# EAGLE design ATtiny_dev_board (EAGLE 9.1.3)
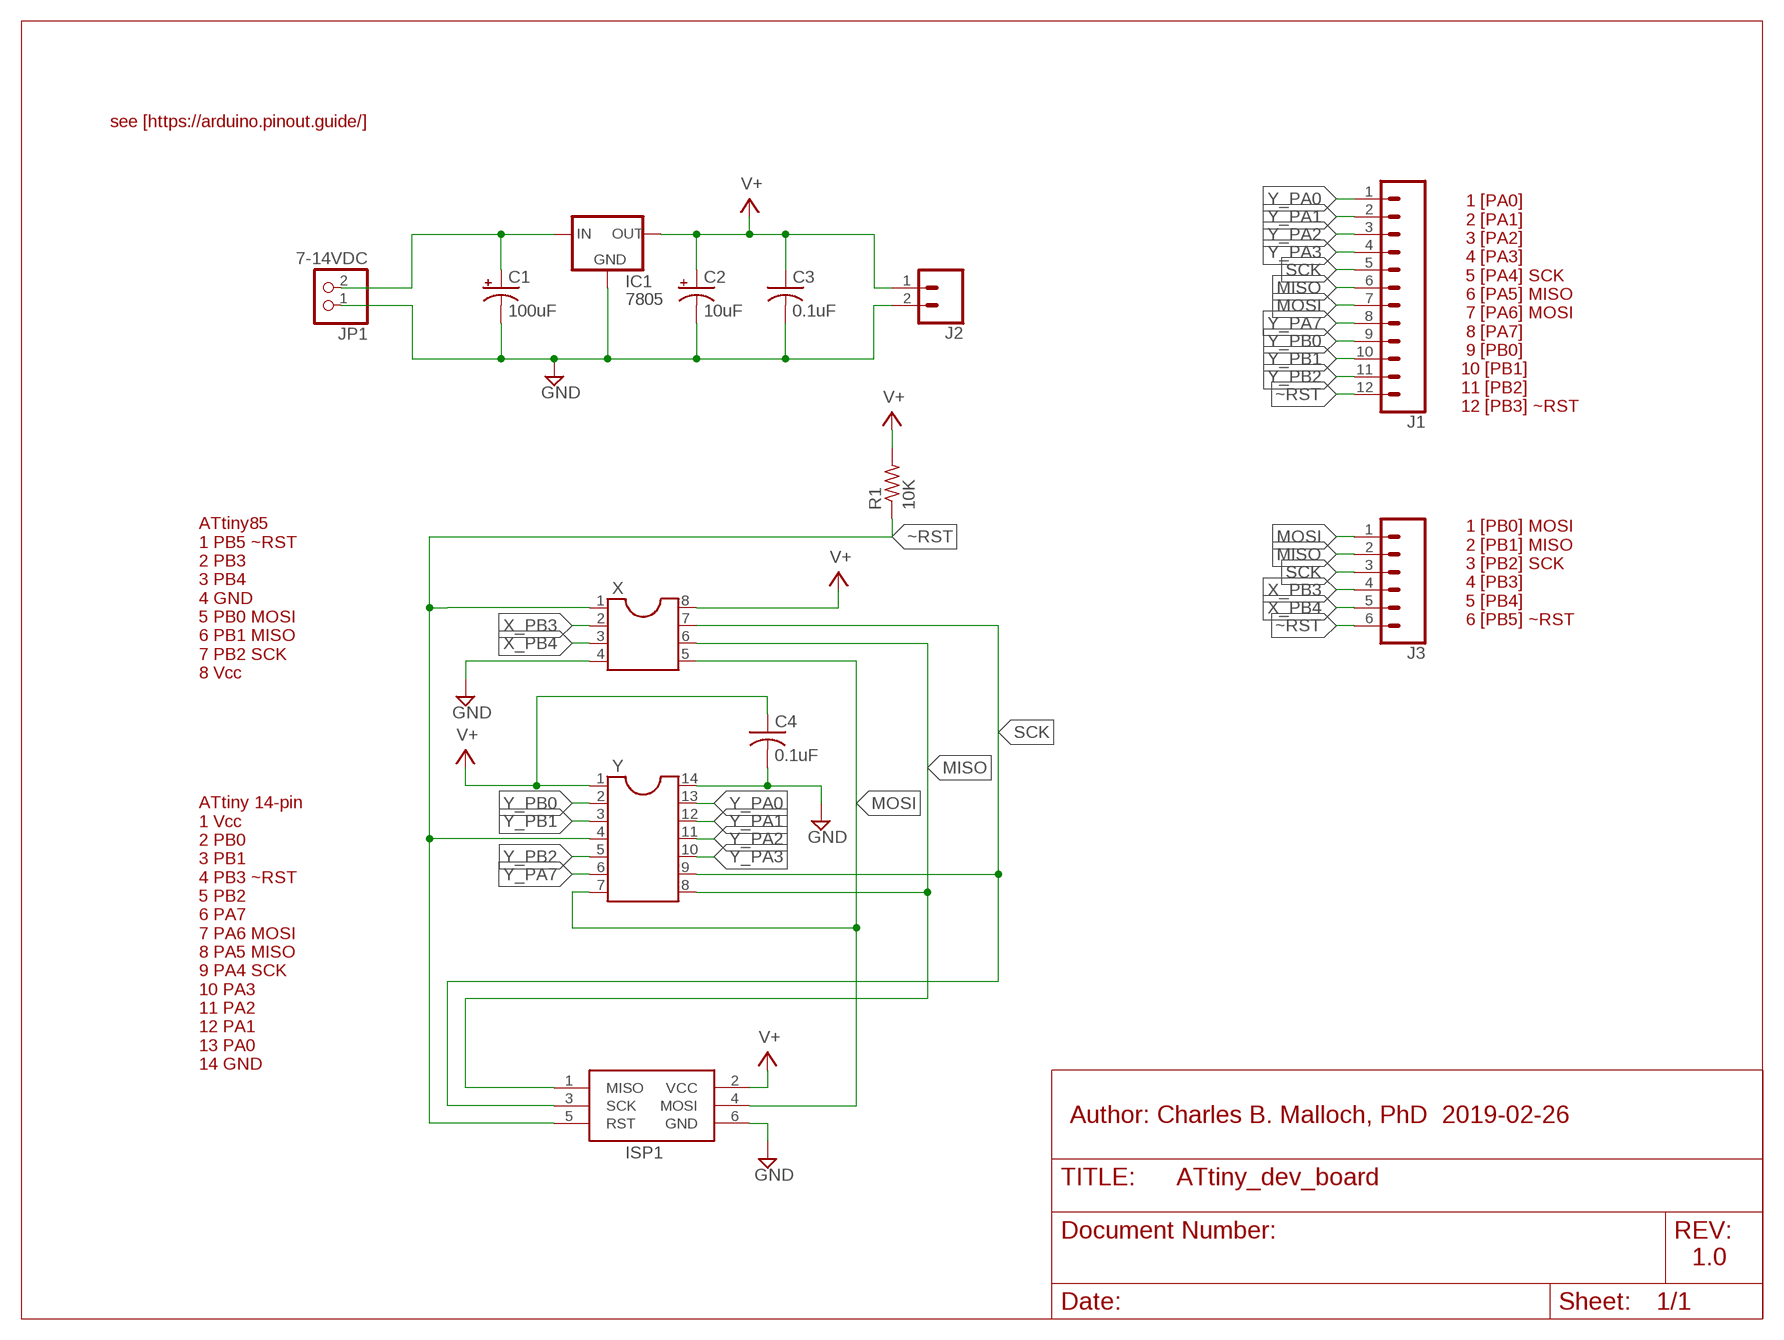
[diagram p0: schematic, sheet 1]

## Parts
C1  100uF  CPOL-USTT2D7  [TT2D7]
C2  10uF  CPOL-USE1.8-4  [E1,8-4]
C3  0.1uF  C-US025-025X050  [C025-025X050]
C4  0.1uF  C-US025-025X050  [C025-025X050]
IC1  7805  V_REG_78XX-TO-220  [TO-220-ALT]
ISP1  AVRISP-BOX  [AVRISP-BOX]
J1  CONN_12LOCK_LONGPADS  [1X12_LOCK_LONGPADS]
J2  CONN_02LOCK_LONGPADS  [1X02_LOCK_LONGPADS]
J3  CONN_06LOCK_LONGPADS  [1X06_LOCK_LONGPADS]
JP1  7-14VDC  PINHD-1X2  [1X02]
R1  10K  R-US_0309/12  [0309/12]
X  DIL8S  [SOCKET-08]
Y  DIL14S  [SOCKET-14]

## Nets
5VDC [POWER]: C2.+ C3.1 C4.1 IC1.OUT ISP1.2(VCC) J2.1 R1.2 X.8 Y.1 ; supply symbol labelled V+
GND [POWER]: C1.- C2.- C3.2 C4.2 IC1.GND ISP1.6(GND) J2.2 JP1.1 X.4 Y.14
MISO: ISP1.1(MISO) J1.6 J3.2 X.6 Y.8
MOSI: ISP1.4(MOSI) J1.7 J3.1 X.5 Y.7
SCK: ISP1.3(SCK) J1.5 J3.3 X.7 Y.9
VIN [POWER]: C1.+ IC1.IN JP1.2
X_PB3: J3.4 X.2
X_PB4: J3.5 X.3
Y_PA0: J1.1 Y.13
Y_PA1: J1.2 Y.12
Y_PA2: J1.3 Y.11
Y_PA3: J1.4 Y.10
Y_PA7: J1.8 Y.6
Y_PB0: J1.9 Y.2
Y_PB1: J1.10 Y.3
Y_PB2: J1.11 Y.5
~RST: ISP1.5(RST) J1.12 J3.6 R1.1 X.1 Y.4

## Notes on the sheet
- see [https://arduino.pinout.guide/]
- 1 [PA0]
   2 [PA1]
   3 [PA2]
   4 [PA3]
   5 [PA4] SCK
   6 [PA5] MISO
   7 [PA6] MOSI
   8 [PA7]
   9 [PB0]
  10 [PB1]
  11 [PB2]
  12 [PB3] ~RST
- 1 [PB0] MOSI
   2 [PB1] MISO
   3 [PB2] SCK
   4 [PB3]
   5 [PB4]
   6 [PB5] ~RST
- ATtiny85
  1 PB5 ~RST
  2 PB3
  3 PB4
  4 GND
  5 PB0 MOSI
  6 PB1 MISO
  7 PB2 SCK
  8 Vcc
- ATtiny 14-pin
  1 Vcc
  2 PB0
  3 PB1
  4 PB3 ~RST
  5 PB2
  6 PA7
  7 PA6 MOSI
  8 PA5 MISO
  9 PA4 SCK
  10 PA3
  11 PA2
  12 PA1
  13 PA0
  14 GND
- Author: Charles B. Malloch, PhD  2019-02-26
- 1.0

## Library data of the parts
C1 C2 = adafruit:CPOL-US: POLARIZED CAPACITOR, American symbol
C3 C4 = adafruit:C-US: CAPACITOR, American symbol
IC1 = SparkFun-PowerIC:V_REG_78XX: Voltage Regulator Standard 7805 5V regulator. IGO (Input Ground Output). Spark Fun Electronics SKU : COM-00107
ISP1 = adafruit:AVRISP: AVR ISP HEADER Standard 6 pin header for AVR programming
J1 = SparkFun-Connectors:CONN_12: Multi connection point. Often used as Generic Header-pin footprint for 0.1 inch spaced/style header connections On any of the 0.1 inch spaced packages, you can populate with these: Break Away Headers - Straight <https://www.sparkfun.com/products/116> (PRT-00116) Break Away Male Headers - Right Angle <https://www.sparkfun.com/products/553> (PRT-00553) Female Headers <https://www.sparkfun.com/products/115> (PRT-00115) Break Away Headers - Machine Pin <https://www.sparkfun.com/products/117> (PRT-00117) Break Away Female Headers - Swiss Machine Pin <https://www.sparkfun.com/products/743> (PRT-00743) For SCREWTERMINALS and SPRING TERMINALS visit here: Screw Terimnals on SparkFun.com <https://www.sparkfun.com/search/results?term=Screw+Terminals> (5mm/3.5mm/2.54mm spacing) This device is also useful as a general connection point to wire up your design to another part of your project. Our various solder wires solder well into these plated through hole pads. Hook-Up Wire - Assortment (Stranded, 22 AWG) <https://www.sparkfun.com/products/11375> (PRT-11375) Hook-Up Wire - Assortment (Solid Core, 22 AWG) <https://www.sparkfun.com/products/11367> (PRT-11367) View the entire wire category on our website here <https://www.sparkfun.com/categories/141> Special notes: Molex polarized connector foot print use with SKU : PRT-08231 with associated crimp pins and housings. 1MM SMD Version SKU: PRT-10208 NOTES ON THE VARIANTS LOCK and LOCK_LONGPADS... This footprint was designed to help hold the alignment of a through-hole component (i.e. 6-pin header) while soldering it into place. You may notice that each hole has been shifted either up or down by 0.005 of an inch from it's more standard position (which is a perfectly straight line). This slight alteration caused the pins (the squares in the middle) to touch the edges of the holes. Because they are alternating, it causes a "brace" to hold the component in place. 0.005 has proven to be the perfect amount of "off-center" position when using our standard breakaway headers. Although looks a little odd when you look at the bare footprint, once you have a header in there, the alteration is very hard to notice. Also,if you push a header all the way into place, it is covered up entirely on the bottom side.
J2 = SparkFun-Connectors:CONN_02: Multi connection point. Often used as Generic Header-pin footprint for 0.1 inch spaced/style header connections On any of the 0.1 inch spaced packages, you can populate with these: Break Away Headers - Straight <https://www.sparkfun.com/products/116> (PRT-00116) Break Away Male Headers - Right Angle <https://www.sparkfun.com/products/553> (PRT-00553) Female Headers <https://www.sparkfun.com/products/115> (PRT-00115) Break Away Headers - Machine Pin <https://www.sparkfun.com/products/117> (PRT-00117) Break Away Female Headers - Swiss Machine Pin <https://www.sparkfun.com/products/743> (PRT-00743) For SCREWTERMINALS and SPRING TERMINALS visit here: Screw Terimnals on SparkFun.com <https://www.sparkfun.com/search/results?term=Screw+Terminals> (5mm/3.5mm/2.54mm spacing) This device is also useful as a general connection point to wire up your design to another part of your project. Our various solder wires solder well into these plated through hole pads. Hook-Up Wire - Assortment (Stranded, 22 AWG) <https://www.sparkfun.com/products/11375> (PRT-11375) Hook-Up Wire - Assortment (Solid Core, 22 AWG) <https://www.sparkfun.com/products/11367> (PRT-11367) View the entire wire category on our website here <https://www.sparkfun.com/categories/141> Special notes: Molex polarized connector foot print use with: PRT-08233 with associated crimp pins and housings. 2.54_SCREWTERM for use with PRT-10571. 3.5mm Screw Terminal footprints for PRT-08084 5mm Screw Terminal footprints for use with PRT-08432
J3 = SparkFun-Connectors:CONN_06: Multi connection point. Often used as Generic Header-pin footprint for 0.1 inch spaced/style header connections On any of the 0.1 inch spaced packages, you can populate with these: Break Away Headers - Straight <https://www.sparkfun.com/products/116> (PRT-00116) Break Away Male Headers - Right Angle <https://www.sparkfun.com/products/553> (PRT-00553) Female Headers <https://www.sparkfun.com/products/115> (PRT-00115) Break Away Headers - Machine Pin <https://www.sparkfun.com/products/117> (PRT-00117) Break Away Female Headers - Swiss Machine Pin <https://www.sparkfun.com/products/743> (PRT-00743) Arduino Stackable Header - 6 Pin <https://www.sparkfun.com/products/9280> (PRT-09280) For SCREWTERMINALS and SPRING TERMINALS visit here: Screw Terimnals on SparkFun.com <https://www.sparkfun.com/search/results?term=Screw+Terminals> (5mm/3.5mm/2.54mm spacing) This device is also useful as a general connection point to wire up your design to another part of your project. Our various solder wires solder well into these plated through hole pads. Hook-Up Wire - Assortment (Stranded, 22 AWG) <https://www.sparkfun.com/products/11375> (PRT-11375) Hook-Up Wire - Assortment (Solid Core, 22 AWG) <https://www.sparkfun.com/products/11367> (PRT-11367) View the entire wire category on our website here <https://www.sparkfun.com/categories/141>
JP1 = pinhead:PINHD-1X2: PIN HEADER
R1 = resistor:R-US_: RESISTOR, American symbol
X = ic-package:DIL8: Dual In Line / Socket
Y = ic-package:DIL14: Dual In Line / Socket

## Net classes
1 POWER: width 0.61 mm, clearance 0.305 mm

## Board
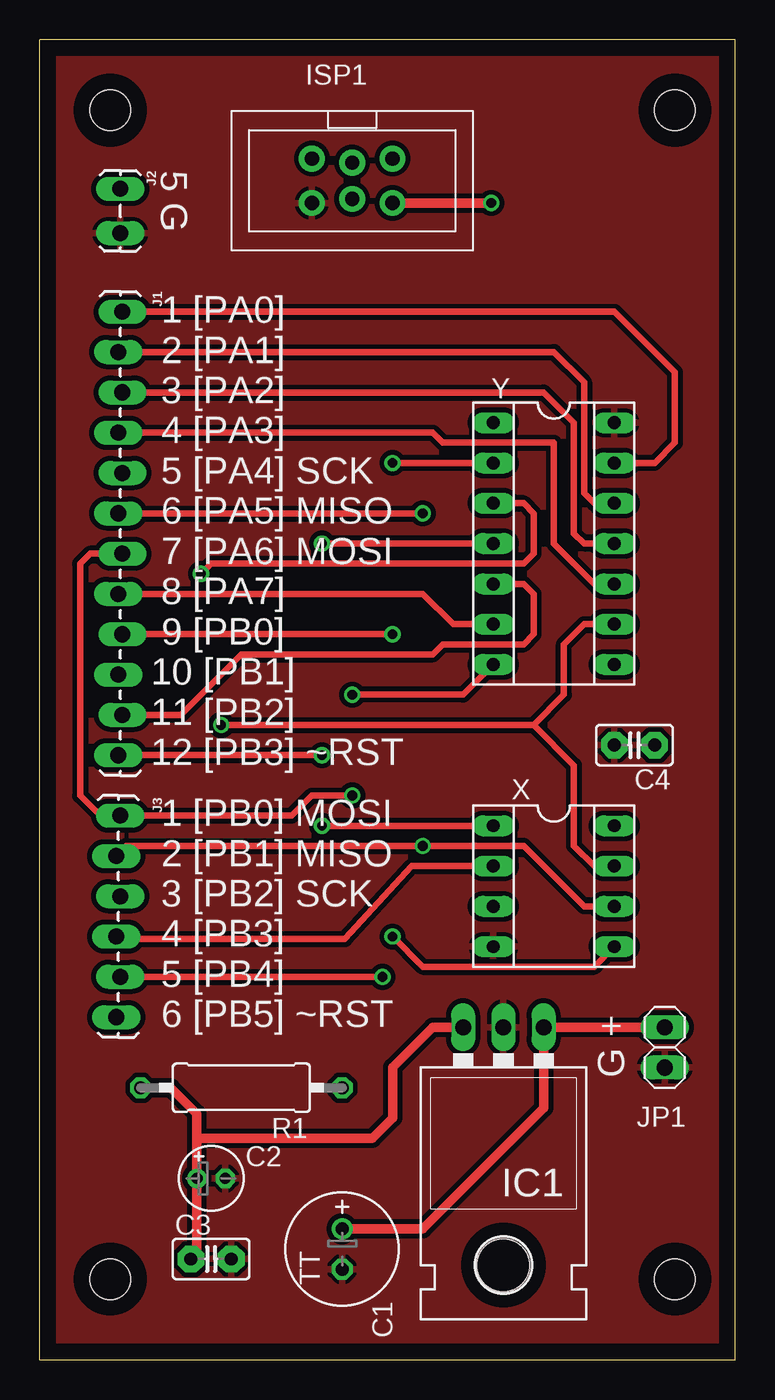
[diagram p1: board, top side]
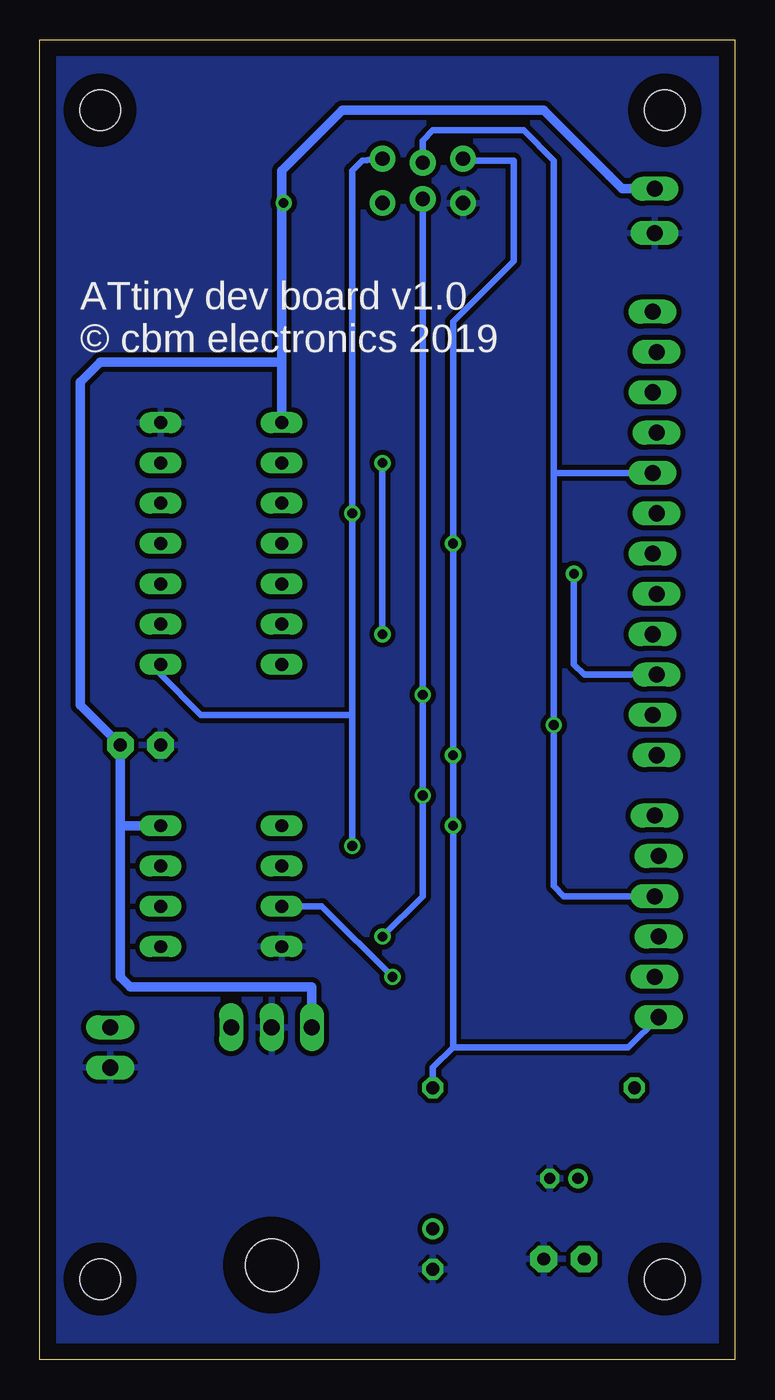
[diagram p2: board, bottom side, seen from below]

Size 43.82 x 83.19 mm. Coordinates in mm from the lower left corner, seen from the top.
Outline: 0,0 43.82,0 43.82,83.19 0,83.19 0,0
Copper layers (1*16): Top 0.035mm / dielectric 1.5mm / Bottom 0.035mm
Design rules "default": minimum track width 10mil, minimum drill 24mil, track to track 8mil, track to pad 8mil, pad to pad 8mil, via to via 8mil, smd to smd 8mil, copper to edge 40mil, drill to drill 8mil, minimum pad ring 10mil, minimum via ring 8mil, stop-mask expansion 4mil, vias tented up to drill 0mil, thermal gap 10mil
Holes 2.54 mm at 4.45,5.08 40.01,5.08 40.01,78.74 4.45,78.74

### Footprints (pad centres in the part's own frame; a part is rotated, then mirrored left to right if it is on the bottom)
TT2D7 = drill 0.813: + -1.27,0 | drill 0.813 octagon: - 1.27,0
E1,8-4 = drill 0.711 pad 1.168: + -0.889,0 | drill 0.711 pad 1.168 octagon: - 0.889,0
C025-025X050 = drill 0.813 pad 1.676 octagon: 1 -1.27,0; 2 1.27,0
TO-220-ALT = drill 1.016 long: GND 0,-3.81; IN -2.54,-3.81; OUT 2.54,-3.81 | hole 3.302: 0,11.176
AVRISP-BOX = drill 0.9 pad 1.626: 1 -1.397,2.54; 2 1.397,2.54; 3 -1.143,0; 4 1.143,0; 5 -1.397,-2.54; 6 1.397,-2.54
1X12_LOCK_LONGPADS = drill 1.016 long: 1 0,0.127; 2 2.54,-0.127; 3 5.08,0.127; 4 7.62,-0.127; 5 10.16,0.127; 6 12.7,-0.127; 7 15.24,0.127; 8 17.78,-0.127; 9 20.32,0.127; 10 22.86,-0.127; 11 25.4,0.127; 12 27.94,-0.127
1X02_LOCK_LONGPADS = drill 1.016 long: 1 -0.127,0; 2 2.667,0
1X06_LOCK_LONGPADS = drill 1.016 long: 1 0,0; 2 2.54,-0.254; 3 5.08,0; 4 7.62,-0.254; 5 10.16,0; 6 12.7,-0.254
1X02 = drill 1.016 long: 1 -1.27,0; 2 1.27,0
0309/12 = drill 0.813 octagon: 1 -6.35,0; 2 6.35,0
SOCKET-08 = drill 0.813 long: 1 -3.81,-3.81; 2 -1.27,-3.81; 3 1.27,-3.81; 4 3.81,-3.81; 5 3.81,3.81; 6 1.27,3.81; 7 -1.27,3.81; 8 -3.81,3.81
SOCKET-14 = drill 0.813 long: 1 -7.62,-3.81; 2 -5.08,-3.81; 3 -2.54,-3.81; 4 0,-3.81; 5 2.54,-3.81; 6 5.08,-3.81; 7 7.62,-3.81; 8 7.62,3.81; 9 5.08,3.81; 10 2.54,3.81; 11 0,3.81; 12 -2.54,3.81; 13 -5.08,3.81; 14 -7.62,3.81

### Placement (x,y rotation side)
C1  19.05,6.99 270 top
C2  10.79,11.43 0 top
C3  10.79,6.35 0 top
C4  37.47,38.73 180 top
IC1  29.21,17.14 180 top
ISP1  19.68,74.3 270 top
J1  5.08,66.04 270 top
J2  5.08,73.66 270 top
J3  5.08,34.29 270 top
JP1  39.37,19.68 90 top
R1  12.7,17.14 180 top
X  32.39,29.84 270 top
Y  32.39,51.44 270 top

### Tracks (layer width: path | path; a pad name or v marks a point on that pad's centre or on a via)
5VDC  (via drill 0.61)
  Top 0.61: C3.1 9.91,6.73 C2.+ 9.91,13.97 | R1.2 8.26,17.14 9.91,15.49 9.91,13.97 | IC1.OUT 24.76,20.95 22.22,18.41 22.22,15.24 20.95,13.97 9.91,13.97 | ISP1.2 24.76,72.9 v28.45,72.9
  Bottom 0.61: J2.1 7.11,73.79 7.94,74.61 12.06,78.74 24.76,78.74 28.57,74.93 28.57,73.03 | 28.57,73.03 28.57,62.87 | 28.57,62.87 Y.1 | v28.45,72.9 28.57,73.03 | 28.57,62.87 40.01,62.87 41.27,61.59 41.27,41.27 C4.1 38.73,33.66 | 38.73,33.66 38.73,24.13 38.1,23.5 26.67,23.5 IC1.OUT | X.8 38.73,33.66
GND
  pour Top: 0,0 0,82.55 43.82,82.55 43.82,0
  pour Bottom: 0,0 0,82.55 43.82,82.55 43.82,0
MISO  (via drill 0.61)
  Top 0.406: X.6 34.29,28.57 30.48,32.38 v24.13,32.38 5.46,32.38 J3.2 | J1.6 v24.13,53.34
  Bottom 0.406: ISP1.1 23.49,75.56 24.13,74.93 v24.13,53.34 24.13,40.64 | 24.13,40.64 v24.13,32.38 | Y.8 36.2,43.18 33.66,40.64 24.13,40.64
MOSI  (via drill 0.61)
  Top 0.406: v22.22,26.67 24.13,24.77 34.93,24.77 X.5 | v19.68,35.56 17.14,35.56 15.88,34.29 J3.1 3.81,34.29 2.54,35.56 2.54,50.16 3.17,50.8 J1.7 | Y.7 26.67,41.91 v19.68,41.91
  Bottom 0.406: ISP1.4 v19.68,41.91 v19.68,35.56 19.68,29.21 v22.22,26.67
SCK  (via drill 0.61)
  Top 0.406: v11.43,40.01 31.11,40.01 | Y.9 34.29,46.35 33.02,45.09 33.02,41.91 31.11,40.01 | X.7 34.93,31.11 33.66,32.38 33.66,37.47 31.11,40.01
  Bottom 0.406: ISP1.3 19.68,76.83 19.05,77.47 13.34,77.47 11.43,75.56 11.43,55.88 | J3.3 10.79,29.21 11.43,29.84 v11.43,40.01 11.43,55.88 | J1.5 11.43,55.88
VIN
  Top 0.61: C1.+ 24.13,8.26 31.75,15.88 IC1.IN JP1.2
X_PB3
  Top 0.406: 4.98,26.51 19.22,26.51 23.44,31.11 X.2
  Top 0.61: J3.4 4.98,26.51
X_PB4  (via drill 0.61)
  Top 0.406: J3.5 v21.59,24.13
  Bottom 0.406: X.3 26.04,28.57 v21.59,24.13
Y_PA0
  Top 0.406: J1.1 36.2,66.04 40.01,62.23 40.01,57.78 38.73,56.52 Y.13
Y_PA1
  Top 0.406: J1.2 32.39,63.5 34.29,61.59 34.29,54.61 34.93,53.98 Y.12
Y_PA2
  Top 0.406: J1.3 31.75,60.96 33.66,59.05 33.66,52.07 34.29,51.44 Y.11
Y_PA3
  Top 0.406: J1.4 24.76,58.42 25.4,57.78 32.39,57.78 32.39,51.44 34.93,48.9 Y.10
Y_PA7
  Top 0.406: J1.8 13.34,48.26 24.13,48.26 26.04,46.35 Y.6
Y_PB0  (via drill 0.61)
  Top 0.406: Y.2 v22.22,56.52 | J1.9 v22.22,45.72
  Bottom 0.406: v22.22,56.52 v22.22,45.72
Y_PB1  (via drill 0.61)
  Top 0.406: v10.16,49.53 10.79,50.16 30.48,50.16 31.11,50.8 31.11,53.34 30.48,53.98 Y.3
  Bottom 0.406: J1.10 9.53,43.18 10.16,43.81 v10.16,49.53
Y_PB2
  Top 0.406: J1.11 8.89,40.64 12.7,44.45 24.76,44.45 25.4,45.09 30.48,45.09 31.11,45.72 31.11,48.26 30.48,48.9 Y.5
~RST  (via drill 0.61)
  Top 0.406: X.1 v17.78,33.66 | Y.4 21.59,51.44 | 21.59,51.44 v17.78,51.44 | J1.12 v17.78,38.1 | 21.59,51.44
  Bottom 0.406: J3.6 6.73,19.68 17.78,19.68 | 17.78,19.68 19.05,18.41 R1.1 | 17.78,19.68 v17.78,33.66 v17.78,38.1 v17.78,51.44 17.78,65.41 13.97,69.22 13.97,75.56 17.02,75.56 ISP1.5

### Text on the board
tNames: 5 G | 1 [PA0] / 2 [PA1] / 3 [PA2] / 4 [PA3] / 5 [PA4] SCK / 6 [PA5] MISO / 7 [PA6] MOSI / 8 [PA7] / 9 [PB0] / 10 [PB1] / 11 [PB2] / 12 [PB3] ~RST | 1 [PB0] MOSI / 2 [PB1] MISO / 3 [PB2] SCK / 4 [PB3] / 5 [PB4] / 6 [PB5] ~RST | G +
bNames: ATtiny dev board v1.0 / © cbm electronics 2019